# EasyEDA Pro project HLLRT_Circuit_Full.eprj

# Schematic HP-H09-01
Board Name: Board1; Create Date: 2026-09-03; Page Name: P1; Project Name: HLLRT_Circuit_Full; Schematic Name: HP-H09-01; Update Date: 2026-09-04; Company: EasyEDA.com; Page Size: A4; Version: V1.0
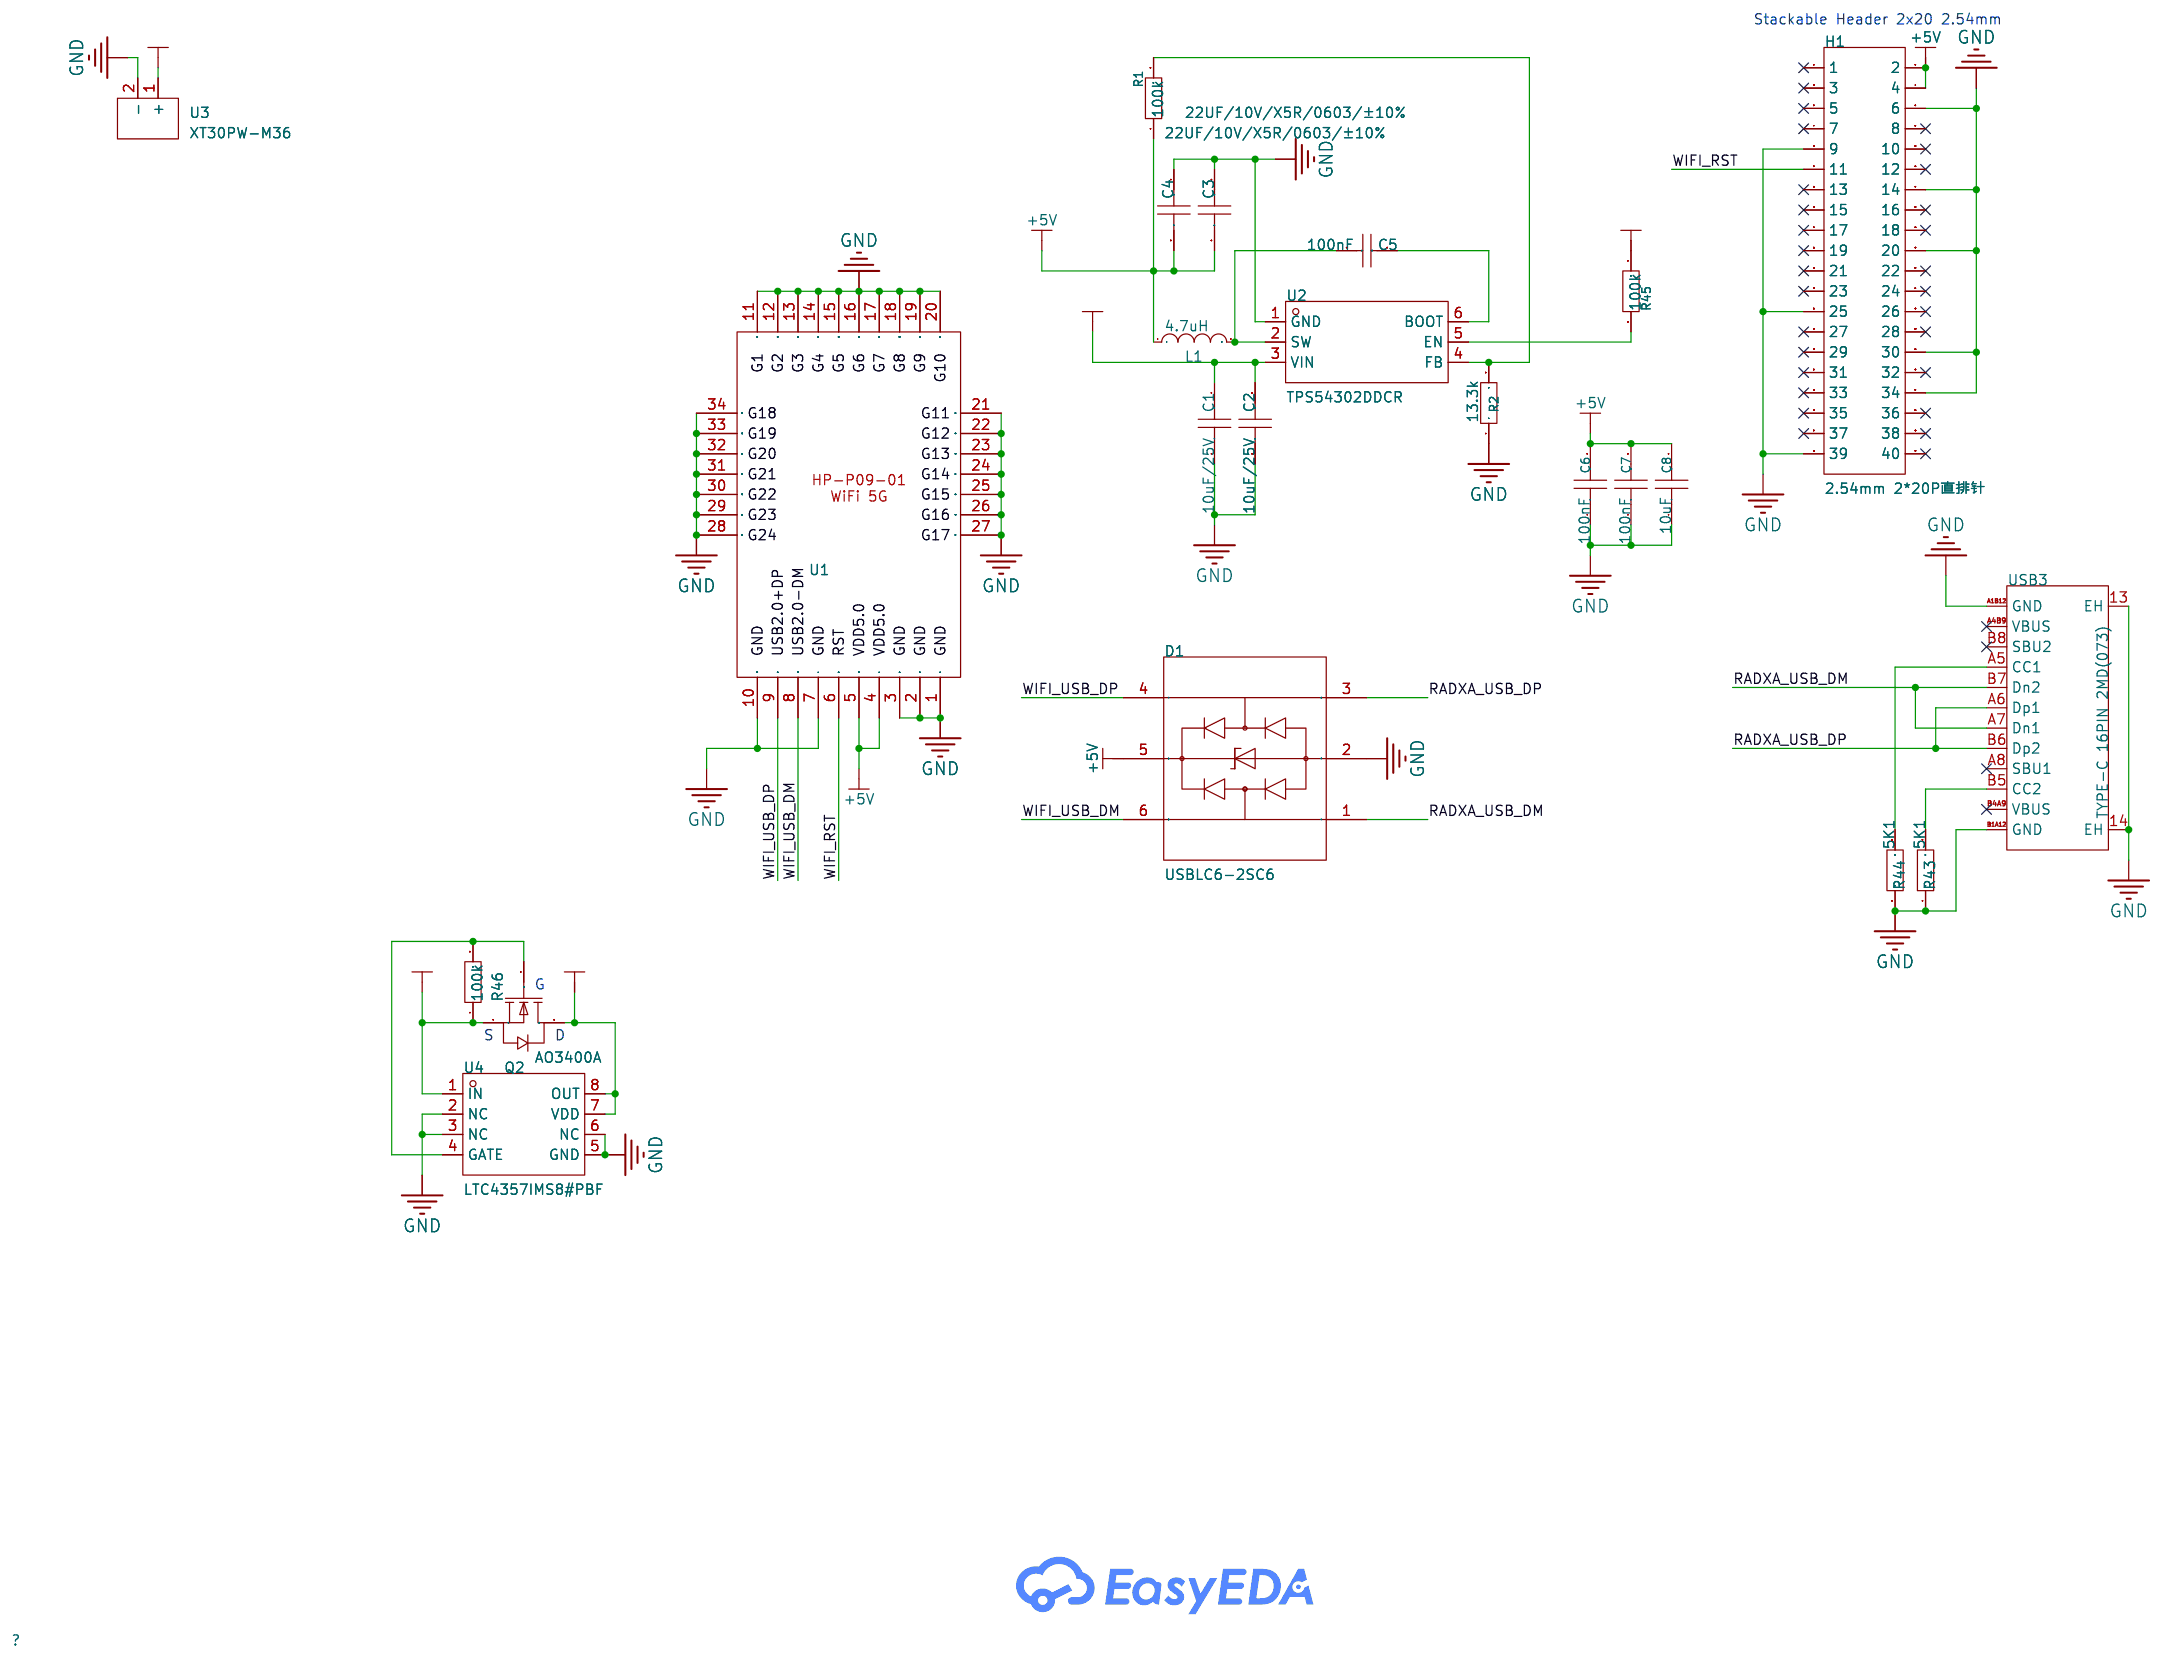
[diagram p0: schematic sheet]

## Parts
C1  10uF/25V  [C1206]
C2  10uF/25V  [C1206]
C3  22UF/10V/X5R/0603/±10%  [C0603]
C4  22UF/10V/X5R/0603/±10%  [C0603]
C5  100nF  [C0603]
C6  100nF  [C0603]
C7  100nF  [C0603]
C8  10uF  [C0603]
D1  USBLC6-2SC6  [SOT-23-6_L2.9-W1.6-P0.95-LS2.8-BL]
H1  2.54mm 2*20P直排针  [HDR-TH_40P-P2.54-V-M-R2-C20-S2.54]
L1  4.7uH  [IND-SMD_L7.3-W7.3_SCDS74T]
Q2  AO3400A  [SOT-23-3_L2.9-W1.3-P1.90-LS2.4-BR]
R1  100k  [R0603]
R2  13.3k  [R0603]
R43  5K1  [R0603]
R44  5K1  [R0603]
R45  100k  [R0603]
R46  100k  [R0603]
U1  -  [HP-H01-01]
U2  TPS54302DDCR  [SOT-23-6_L2.9-W1.6-P0.95-LS2.8-BL]
U3  XT30PW-M36  [CONN-TH_2P-P5.00_XT30PW-M36]
U4  LTC4357IMS8#PBF  [MSOP-8_L3.0-W3.0-P0.65-LS5.0-BL]
USB3  TYPE-C 16PIN 2MD(073)  [USB-C-SMD_TYPE-C-16PIN-2MD-073]

## Library data of the parts
C1 C2 = CL31A476MPHNNNE: LCSC Part Name: 47uF ±20% 10V; Supplier Part: C96123; Manufacturer: SAMSUNG(三星); Supplier Footprint: 1206; JLCPCB Part Class: Basic Part; Datasheet: https://item.szlcsc.com/datasheet/CL31A476MPHNNNE/97327.html; Supplier: LCSC; Tolerance: ±20%; Voltage Rating: 10V; Temperature Coefficient: X5R
C3 C4 = 22UF/10V/X5R/0603/±10%: Supplier Part: C9900023518; JLCPCB Part Class: Extended Part; Supplier: LCSC
C5 = 0603B471K500NT: LCSC Part Name: 470pF ±10% 50V; Supplier Part: C1620; Manufacturer: FH(风华); Supplier Footprint: 0603; JLCPCB Part Class: Basic Part; Datasheet: https://item.szlcsc.com/datasheet/0603B471K500NT/1972.html; Supplier: LCSC; Tolerance: ±10%; Voltage Rating: 50V; Temperature Coefficient: X7R
C6-C8 = CL10A106MA8NRNC: LCSC Part Name: 10uF ±20% 25V; Supplier Part: C96446; Manufacturer: SAMSUNG(三星); Supplier Footprint: 0603; JLCPCB Part Class: Basic Part; Datasheet: https://item.szlcsc.com/datasheet/CL10A106MA8NRNC/97651.html; Supplier: LCSC; Tolerance: ±20%; Voltage Rating: 25V; Temperature Coefficient: X5R
D1 = USBLC6-2SC6: LCSC Part Name: ESD二极管 USBLC6-2SC6; Supplier Part: C323793; Supplier Footprint: SOT-23-6; JLCPCB Part Class: Extended Part; Datasheet: https://atta.szlcsc.com/upload/public/pdf/source/20181029/C323793_48F7908330A3F84485333C8DC43F9E49.pdf; Supplier: LCSC; Reverse Stand-Off Voltage (Vrwm): 5V; Maximum Clamping Voltage: 20V; Peak Pulse Current (Ipp)@10/1000us: 5A; Breakdown Voltage: 6V; Type: ESD
H1 = 2.54mm 2*20P直排针: LCSC Part Name: 2x20P 间距:2.54mm 方针 直插; Supplier Part: C50980; Manufacturer: BOOMELE(博穆精密); Supplier Footprint: 插件,P=2.54mm; JLCPCB Part Class: Extended Part; Datasheet: https://item.szlcsc.com/datasheet/2.54mm%25202*20P%25E7%259B%25B4%25E6%258E%2592%25E9%2592%2588/51992.html; Supplier: LCSC; Pin Structure: 2x20P; Pitch: 2.54mm; Row Spacing: 2.54mm; Circluar Pins/Square Pins: Pin Header; Mounting Type: Through Hole; Number of Rows: 2; Number of Pins: 40P; Current Rating: 3A; Length of Mating Pin: 6mm; Length of End Connection Pin: 3mm; Contact Material: Brass; Operating Temperature: -40℃~+105℃; Color: Black
L1 = L74R/4.7UH: LCSC Part Name: 4.2uH ±20% 7A; Supplier Part: C48686194; Manufacturer: YONGYUTAI(永裕泰); Supplier Footprint: SMD,7.3x7.3mm; JLCPCB Part Class: Extended Part; Datasheet: https://item.szlcsc.com/datasheet/L74R%252F4.7UH/50971527.html; Supplier: LCSC; Tolerance: ±20%; Current - Saturation(Isat): 7A; DC Resistance(DCR): 30mΩ
Q2 = AO3400A_C20917: LCSC Part Name: N沟道 耐压:30V; Supplier Part: C20917; Manufacturer: AOS; Supplier Footprint: SOT-23; JLCPCB Part Class: Basic Part; Datasheet: https://item.szlcsc.com/datasheet/AO3400A/21629.html; Supplier: LCSC; Number: 1 N-channel; Drain to Source Voltage: 30V; Current - Continuous Drain(Id): 5.7A; RDS(on): 48mΩ@2.5V; Pd - Power Dissipation: 1.4W; Gate Threshold Voltage (Vgs(th)): 1.45V; Gate Charge(Qg): 7nC@10V; Input Capacitance(Ciss): 630pF; Reverse Transfer Capacitance (Crss@Vds): 50pF; Operating Temperature: -55℃~+150℃; Type: N-Channel; Output Capacitance(Coss): 75pF; Vgs: ±12V
R1 R2 R45 = 0603WAF2200T5E: LCSC Part Name: 220Ω ±1% 100mW 厚膜电阻; Supplier Part: C22962; Manufacturer: UNI-ROYAL(厚声); Supplier Footprint: 0603; JLCPCB Part Class: Basic Part; Datasheet: https://atta.szlcsc.com/upload/public/pdf/source/20200306/C422600_1E6D84923E4A46A82E41ADD87F860B5C.pdf; Supplier: LCSC; Type: Thick Film Resistors; Tolerance: ±1%; Temperature Coefficient: ±100ppm/℃; Operating Temperature Range: -55℃~+155℃
R43 R44 R46 = Res_0603: Supplier Footprint: 0603
U1 = HP-H09-01
U2 = TPS54302DDCR_C311983: LCSC Part Name: 降压型 3A 4.5V~28V; Supplier Part: C311983; Manufacturer: TI(德州仪器); Supplier Footprint: TSOT-23-6; JLCPCB Part Class: Extended Part; Datasheet: https://www.ti.com/cn/lit/gpn/tps54302; Supplier: LCSC; Function: Step-down type; Voltage - Supply: 4.5V~28V; Output Current: 3A; Frequency - Switching: 400kHz; Operating Temperature: -40℃~+125℃@(TJ); Synchronous Rectifier: Yes; Number of Outputs: 1; Topology: Buck; Quiescent Current: 45uA; Switch tube (built-in/external): Built-in; Output Type: Adjustable; Features: Light load efficient mode；Cycle-by-cycle current limiting；Overcurrent Protection；EMI optimization (spread spectrum)；Hiccup current limiting
U3 = XT30PW-M36: Supplier Part: C9900222726; Supplier Footprint: XT30; Supplier: LCSC
U4 = LTC4357IMS8#PBF: LCSC Part Name: 正高电压理想二极管控制器; Supplier Part: C580864; Manufacturer: ADI(亚德诺); Supplier Footprint: MSOP-8; JLCPCB Part Class: Extended Part; Datasheet: https://item.szlcsc.com/datasheet/LTC4357IMS8%2523PBF/608641.html; Supplier: LCSC
USB3 = TYPE-C 16PIN 2MD(073): Connector Type:Type-C Protocol Standard:- Gender:Female Mounting Type:Surface Mount, Right Angle Number of Contacts:16P Number of Ports:1 Current Rating-Power:3A Voltage Rating:5V Connect-Disconnect Life:10,000 cycles Supplementary Features:- Center Heigh; LCSC Part Name: Type-C 母 卧贴; Supplier Part: C2765186; Manufacturer: SHOU HAN(首韩); Supplier Footprint: SMD; JLCPCB Part Class: Extended Part; Datasheet: https://item.szlcsc.com/datasheet/TYPE-C%252016PIN%25202MD(073)/2901843.html; Supplier: LCSC; Connector Type: Type-C; Gender: Female; Mounting Type: Surface Mount, Right Angle; Number of Contacts: 16P; Number of Ports: 1; Current Rating-Power: 3A; Voltage Rating: 5V; Connect-Disconnect Life: 10,000 cycles; Detection color: Black; Operating Temperature: -25℃~+85℃

## Nets
+5V: C3.2 C4.2 C6.2 C7.2 C8.2 D1.5 H1.2 H1.4 L1.1 R1.1 U1.4 U1.5
GND: C1.1 C2.1 C3.1 C4.1 C6.1 C7.1 C8.1 D1.2 H1.6 H1.9 H1.14 H1.20 H1.25 H1.30 H1.34 H1.39 R2.1 R43.1 R44.1 U1.1 U1.2 U1.3 U1.7 U1.10 U1.11 U1.12 U1.13 U1.14 U1.15 U1.16 U1.17 U1.18 U1.19 U1.20 U1.21 U1.22 U1.23 U1.24 U1.25 U1.26 U1.27 U1.28 U1.29 U1.30 U1.31 U1.32 U1.33 U1.34 U2.1(GND) U3.2(-) U4.2(NC) U4.3(NC) U4.5(GND) U4.6(NC) USB3.13(EH) USB3.14(EH) USB3.A1B12(GND) USB3.B1A12(GND)
VIN_BAT: C1.2 C2.2 Q2.3(D) R45.1 U2.3(VIN) U4.7(VDD) U4.8(OUT)
3S-4S: Q2.2(S) R46.1 U3.1(+) U4.1(IN)
RADXA_USB_DM: D1.1 USB3.A7(Dn1) USB3.B7(Dn2)
RADXA_USB_DP: D1.3 USB3.A6(Dp1) USB3.B6(Dp2)
WIFI_RST: H1.11 U1.6
WIFI_USB_DM: D1.6 U1.8
WIFI_USB_DP: D1.4 U1.9
$1N1982: C5.1 L1.2 U2.2(SW)
$1N3918: R44.2 USB3.A5(CC1)
$1N3919: R43.2 USB3.B5(CC2)
$1N5216: R45.2 U2.5(EN)
$1N5862: Q2.1(G) R46.2 U4.4(GATE)
$1N6068: C5.2 U2.6(BOOT)
$1N6073: R1.2 R2.2 U2.4(FB)

Not connected (* = marked no-connect by the designer): H1 1* 3* 5* 7* 8* 10* 12* 13* 15* 16* 17* 18* 19* 21* 22* 23* 24* 26* 27* 28* 29* 31* 32* 33* 35* 36* 37* 38* 40*; USB3 A4B9(VBUS)* A8(SBU1)* B4A9(VBUS)* B8(SBU2)*

## Notes on the sheet
- Stackable Header 2x20 2.54mm
- G
- S
- D

# Board PCB1
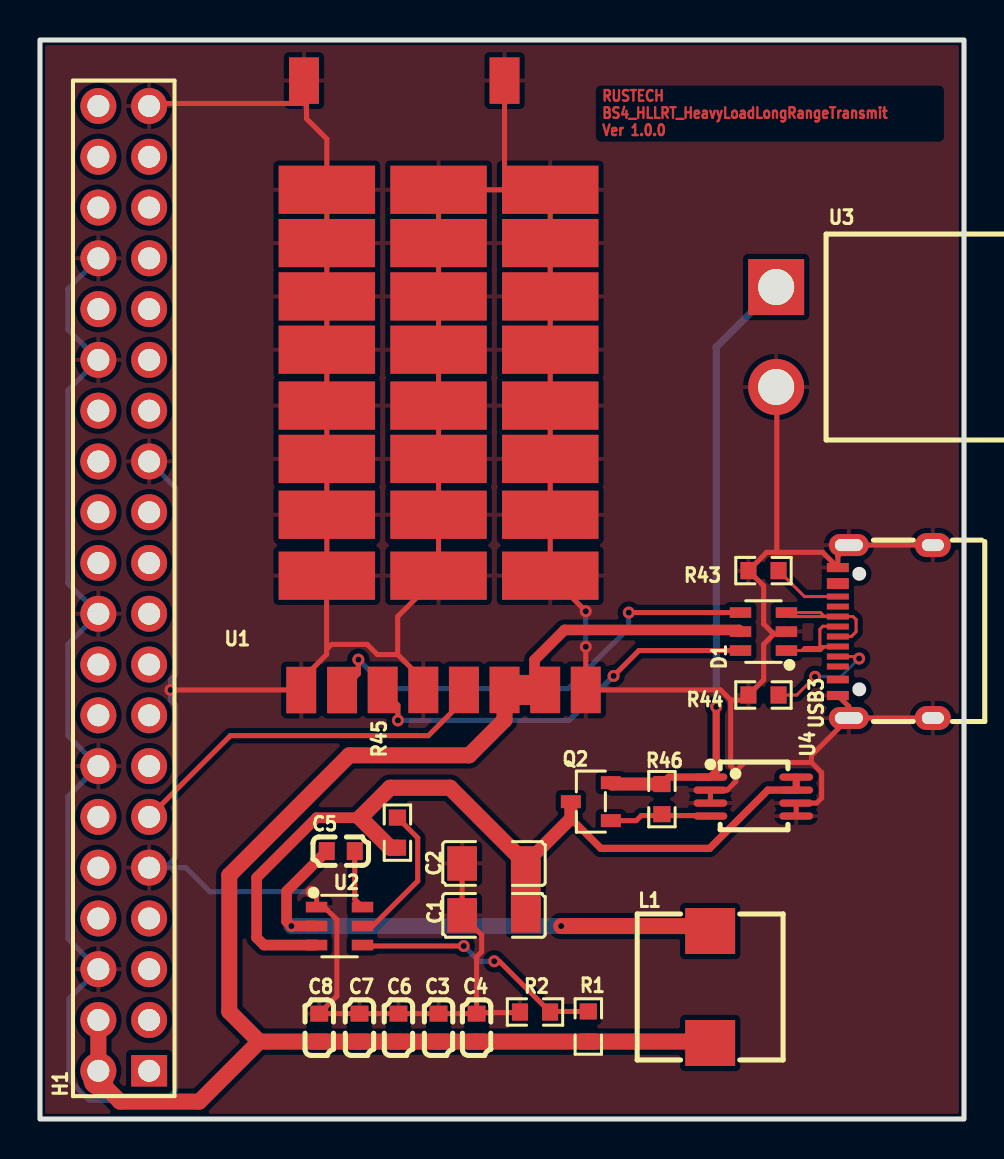
[diagram p1: board, top side]
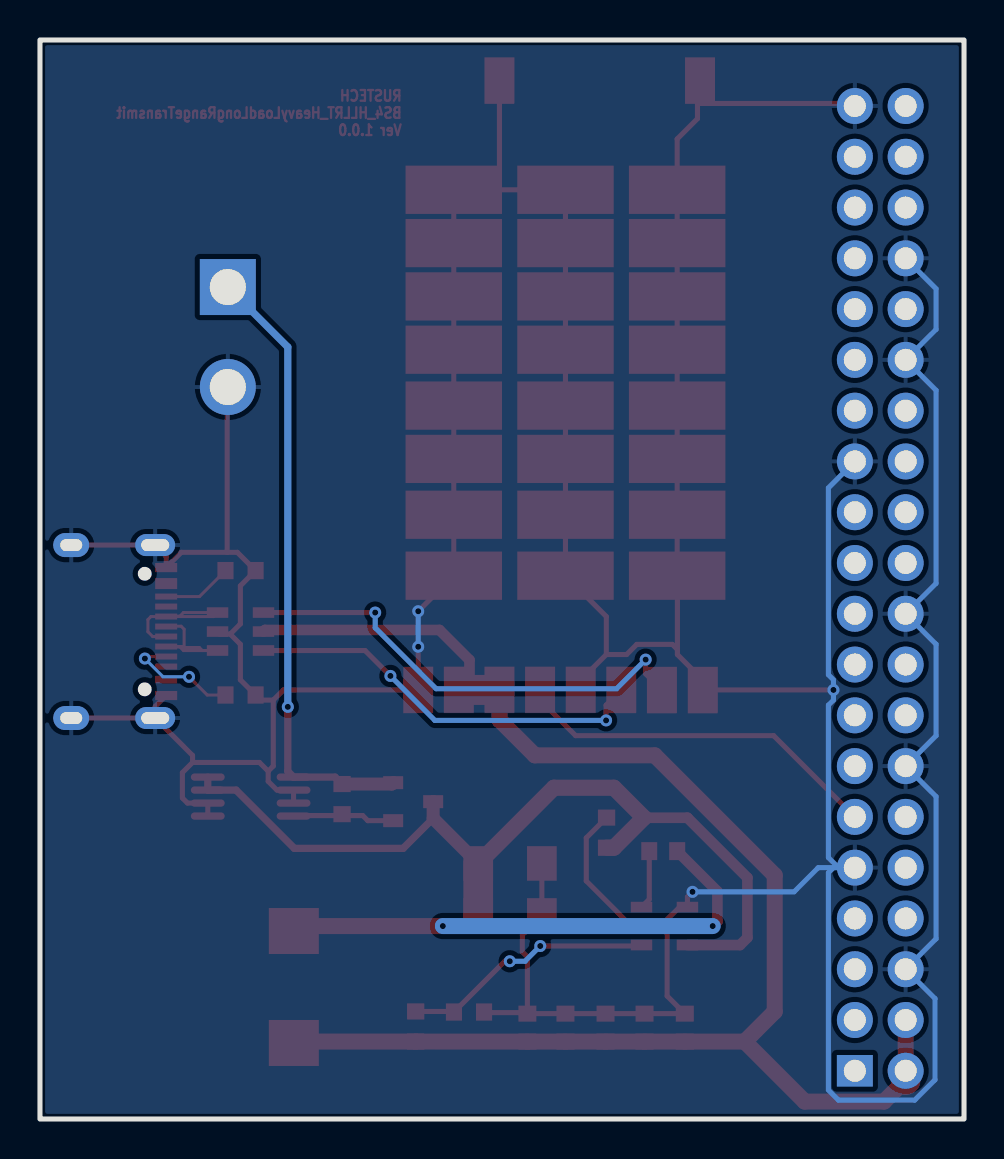
[diagram p2: board, bottom side, seen from below]

Outline 46.23 x 53.98 mm; copper layers: Top Layer, Bottom Layer. Coordinates in mm from the lower left corner of the outline.
Outline path: rectangle 0,53.98 46.23,0
Stack: Top Layer 0.035mm / Dielectric1 1.51mm FR4 er 4.5 / Bottom Layer 0.035mm

## Design rules (mm)
net +5V: PWR
net 3S-4S: PWR
net $1N1982: PWR
net $1N3919: Ok
net $1N3918: Ok
net VIN_BAT: PWR
template: PWR
spacing copperThickness1oz (default): track to track 0.254, other pairs 0.152 to 0.254
spacing copperThickness2oz: track to track 0.203, other pairs 0.152 to 0.3
track width copperThickness1oz (default): min 0.127, default 0.254, max 2.54
track width copperThickness2oz: min 0.203, default 0.254, max 2.54
track width Power_Width: min 0.127, default 1.5, max 2.54
track width USB: min 0.127, default 0.152, max 2.54
track width Ok: min 0.127, default 0.152, max 2.54
differential pair differentialPair (default): width min 0.127, default 0.254, max 2.54; gap min 0.152, default 0.152
via viaSize (default): diameter min 0.5, default 0.6, max 10; hole min 0.3, default 0.305, max 6.3
net class PWR uses Power_Width
net class Ok uses Ok
net +5V uses Power_Width
net 3S-4S uses Power_Width
net RADXA_USB_DM uses USB
net RADXA_USB_DP uses USB
net $1N1982 uses Power_Width
net $1N3919 uses Ok
net $1N3918 uses Ok
net VIN_BAT uses Power_Width
['net', '3s-4s'] ['NET', '+5V'] uses default

## Placement (name value [footprint] x y rotation side)
C1  10uF/25V  [C1206]  22.71 10.18 0 top
C2  10uF/25V  [C1206]  22.71 12.78 0 top
C3  22UF/10V/X5R/0603/±10%  [C0603]  19.94 4.57 270 top
C4  22UF/10V/X5R/0603/±10%  [C0603]  21.84 4.57 270 top
C5  100nF  [C0603]  15.05 13.4 0 top
C6  100nF  [C0603]  17.93 4.57 270 top
C7  100nF  [C0603]  15.98 4.57 270 top
C8  10uF  [C0603]  13.97 4.57 270 top
D1  USBLC6-2SC6  [SOT-23-6_L2.9-W1.6-P0.95-LS2.8-BL]  36.19 24.38 90 top
H1  2.54mm 2*20P直排针  [HDR-TH_40P-P2.54-V-M-R2-C20-S2.54]  4.19 26.54 90 top
L1  4.7uH  [IND-SMD_L7.3-W7.3_SCDS74T]  33.53 6.6 90 top
Q2  AO3400A  [SOT-23-3_L2.9-W1.3-P1.90-LS2.4-BR]  27.56 15.88 0 top
R1  100k  [R0603]  27.43 4.63 90 top
R2  13.3k  [R0603]  24.76 5.35 0 top
R43  5K1  [R0603]  36.19 27.43 0 top
R44  5K1  [R0603]  36.19 21.21 0 top
R45  100k  [R0603]  17.88 14.32 90 top
R46  100k  [R0603]  31.12 16 270 top
U1  -  [HP-H01-01]  9.53 21.46 0 top
U2  TPS54302DDCR  [SOT-23-6_L2.9-W1.6-P0.95-LS2.8-BL]  14.99 9.65 270 top
U3  XT30PW-M36  [CONN-TH_2P-P5.00_XT30PW-M36]  36.83 39.12 90 top
U4  LTC4357IMS8#PBF  [MSOP-8_L3.0-W3.0-P0.65-LS5.0-BL]  35.69 16.13 270 top
USB3  TYPE-C 16PIN 2MD(073)  [USB-C-SMD_TYPE-C-16PIN-2MD-073]  42.29 24.38 90 top

## Footprints (pads in the part's own frame, mm; a bottom-side part is the same pattern mirrored in y, then rotated)
C0603
  rect 0.8x0.9 smd: 1(-0.7,0) 2(0.7,0)
C1206
  rect 1.485x1.728 smd: 1(-1.593,0) 2(1.593,0)
CONN-TH_2P-P5.00_XT30PW-M36
  rect 2.8x2.8 hole 1.8: 1(2.5,0)
  round 2.8 hole 1.8: 2(-2.5,0)
HDR-TH_40P-P2.54-V-M-R2-C20-S2.54
  rect 1.575x1.8 hole 1.1: 1(-24.13,-1.27)
  round 1.8 hole 1.1: 2(-24.13,1.27) 3(-21.59,-1.27) 4(-21.59,1.27) 5(-19.05,-1.27) 6(-19.05,1.27) 7(-16.51,-1.27) 8(-16.51,1.27) 9(-13.97,-1.27) 10(-13.97,1.27) 11(-11.43,-1.27) 12(-11.43,1.27) 13(-8.89,-1.27) 14(-8.89,1.27) 15(-6.35,-1.27) 16(-6.35,1.27) 17(-3.81,-1.27) 18(-3.81,1.27) 19(-1.27,-1.27) 20(-1.27,1.27) 21(1.27,-1.27) 22(1.27,1.27) 23(3.81,-1.27) 24(3.81,1.27) 25(6.35,-1.27) 26(6.35,1.27) 27(8.89,-1.27) 28(8.89,1.27) 29(11.43,-1.27) 30(11.43,1.27) 31(13.97,-1.27) 32(13.97,1.27) 33(16.51,-1.27) 34(16.51,1.27) 35(19.05,-1.27) 36(19.05,1.27) 37(21.59,-1.27) 38(21.59,1.27) 39(24.13,-1.27) 40(24.13,1.27)
HP-H01-01
  custom 1.5x2.327 smd: 1(3.683,30.48) 2(13.716,30.48) 3(17.78,0) 4(15.748,0) 5(13.716,0) 6(11.684,0) 7(9.652,0) 8(7.62,0) 9(5.588,-0.007) 10(3.544,-0.007)
  custom 4.826x2.413 smd: 11(4.826,25.019) 12(10.414,25.019) 13(16.002,25.019) 14(4.826,22.352) 15(10.414,22.352) 16(4.826,19.685) 17(10.414,19.685) 18(16.002,19.685) 19(4.826,17.018) 20(10.414,17.018) 21(16.002,17.018) 22(4.826,14.224) 23(10.414,14.224) 24(16.002,14.224) 25(4.826,11.557) 26(10.414,11.557) 27(16.002,11.557) 28(4.826,8.763) 29(10.414,8.763) 30(16.002,8.763) 31(4.826,5.715) 32(10.414,5.715) 33(16.002,5.715) 34(16.002,22.352)
IND-SMD_L7.3-W7.3_SCDS74T
  rect 2.3x2.5 smd: 1(-2.8,0) 2(2.8,0)
MSOP-8_L3.0-W3.0-P0.65-LS5.0-BL
  oval 0.364x1.692 smd: 1(-0.975,-2.146) 2(-0.325,-2.146) 3(0.325,-2.146) 4(0.975,-2.146) 5(0.975,2.146) 6(0.325,2.146) 7(-0.325,2.146) 8(-0.975,2.146)
R0603
  rect 0.806x0.864 smd: 1(-0.753,0) 2(0.753,0)
SOT-23-3_L2.9-W1.3-P1.90-LS2.4-BR
  rect 1x0.65 smd: 1(1,-0.95) 2(1,0.95) 3(-1,0)
SOT-23-6_L2.9-W1.6-P0.95-LS2.8-BL
  rect 0.532x1.072 smd: 1(-0.95,-1.149) 2(0,-1.149) 3(0.95,-1.149) 4(0.95,1.149) 5(0,1.149) 6(-0.95,1.149)
USB-C-SMD_TYPE-C-16PIN-2MD-073
  oval 1.1x2 hole 0.6x1.4: 13(-4.325,1.825) 14(4.325,1.825)
  oval 1.2x1.8 hole 0.6x1.1: 13(-4.325,-2.375) 14(4.325,-2.375)
  rect 0.457x1.1 smd: A1B12(-3.2,2.375) B1A12(3.2,2.375)
  rect 0.381x1.1 smd: A4B9(-2.4,2.375)
  rect 0.3x1.1 smd: A5(-1.25,2.375) A6(-0.25,2.375) A7(0.25,2.375) A8(1.25,2.375) B5(1.75,2.375) B6(0.75,2.375) B7(-0.75,2.375) B8(-1.75,2.375)
  rect 0.55x1.1 smd: B4A9(2.4,2.375)

## Nets
As in the schematic.

Pads without a net: H1 1 3 5 7 8 10 12 13 15 16 17 18 19 21 22 23 24 26 27 28 29 31 32 33 35 36 37 38 40; USB3 A4B9 A8 B4A9 B8

## Via types
v1: diameter 0.6, hole 0.305, Top Layer to Bottom Layer, 15 vias

## Routing (per net, layer and track width the routed paths; a pad name or vN(x,y) marks a point on that pad's centre or on a via; arc(x,y) is an arc through that point)
+5V: length 77.2
  Top Layer w0.532: D1.5 34.97,24.46 26.24,24.46 24.74,22.96 24.74,21.46
  Top Layer w0.8: 10.97,3.87 7.97,0.87 4,0.87 2.92,1.95 ; 10.97,3.87 9.47,5.37 9.47,12.19 15.47,18.19 21.47,18.19 23.24,19.96 U1.5 ; 10.97,3.87 C8.2 C7.2 C6.2 C3.2 C4.2 R1.1 ; H1.2 H1.4
  Top Layer w0.806: L1.1 33.46,3.87 R1.1
  Top Layer w1.5: U1.5 U1.4 ; 2.92,1.95 H1.2
GND: length 290.4
  Top Layer w0.254: U1.7 19.18,21.95 17.9,23.23 ; 23.24,46.48 U1.2 ; 23.24,46.48 U1.13 U1.34 U1.18 U1.21 U1.24 U1.27 U1.30 U1.33 v1(27.31,25.4) ; 23.24,46.48 U1.12 U1.15 U1.17 U1.20 U1.23 U1.26 U1.29 U1.32 17.9,25.13 17.9,23.23 ; 17.9,23.23 16.88,23.23 16.37,23.74 14.59,23.74 14.34,23.49 ; 36.86,28.35 36.36,28.35 R43.1 36.2,26.67 36.2,24.77 36.71,24.26 ; 36.86,28.35 36.86,36.58 U3.2 ; 36.86,28.35 39.15,28.35 USB3.B1A12 39.92,28.16 USB3.14 USB3.14 ; USB3.13 USB3.13 ; USB3.13 38.59,18.19 38.59,17.84 ; USB3.13 40.47,20.63 USB3.A1B12 ; v1(6.53,21.46) 13.06,21.46 ; H1.39 5.59,50.8 13.34,50.8 ; 38.59,17.84 35.25,17.84 34.81,17.4 ; 38.59,17.84 39.1,17.33 39.1,16.06 38.85,15.8 U4.6 U4.5 ; v1(13.58,11.36) 13.84,11.11 U2.1 14.23,10.6 14.85,9.98 14.85,6.16 C8.1 C7.1 C6.1 C3.1 C4.1 21.84,5.32 ; 34.81,17.4 34.56,17.65 34.56,20.95 ; 34.81,17.4 34.81,16.89 34.37,16.45 33.54,16.45 33.54,15.8 ; 34.56,20.95 34.05,21.46 U1.3 v1(27.31,23.62) ; 34.56,20.95 35.19,20.95 R44.1 36.2,21.97 36.2,23.75 36.71,24.26 ; 13.34,50.8 13.34,51.82 U1.1 ; 13.34,50.8 13.34,50.04 14.35,49.02 U1.11 U1.14 U1.16 U1.19 U1.22 U1.25 U1.28 U1.31 14.34,27.17 14.34,23.49 ; C2.1 C1.1 22.1,9.21 22.1,8.37 21.84,8.12 21.84,5.32 ; 14.34,23.49 14.34,23.23 13.07,21.96 13.07,21.46 ; 21.84,5.32 23.98,5.32 R2.1 ; 36.71,24.26 37.22,24.26 D1.2
  Bottom Layer w0.254: v1(27.31,25.4) v1(27.31,23.62) ; v1(13.58,11.36) 8.5,11.36 7.29,12.57 6.53,12.57 ; 6.53,12.57 6.79,12.32 6.79,1.45 6.28,0.94 2.47,0.94 1.45,1.96 1.45,6.02 H1.6 1.4,9.02 1.4,16.13 H1.14 1.4,19.18 1.4,23.75 H1.20 1.4,26.8 1.4,36.45 2.92,37.97 1.4,39.5 1.4,41.53 2.92,43.05 ; 6.53,12.57 6.28,12.57 ; 6.28,12.57 6.79,13.08 6.79,20.7 6.53,20.95 v1(6.53,21.46) 6.53,21.97 6.79,22.23 6.79,31.57 H1.25 ; 6.28,12.57 H1.9
VIN_BAT: length 45.9
  Top Layer w0.364: 26.56,15.04 28.06,13.54 33.5,13.54 36.42,16.45 U4.7 U4.8
  Top Layer w0.532: 16.02,15.07 13.84,15.07 10.84,12.07 10.84,9.07 11.21,8.7 U2.3
  Top Layer w0.65: C2.2 26.56,15.04 Q2.3
  Top Layer w0.806: R45.1 17.52,13.57 16.02,15.07 17.52,16.57 20.52,16.57 C2.2
  Top Layer w1.485: C1.2 C2.2
3S-4S: length 31
  Top Layer w0.364: R46.1 31.46,17.1 33.54,17.1 33.83,17.39 v1(33.83,20.62)
  Top Layer w0.65: Q2.2 28.63,16.76 R46.1
  Bottom Layer w0.364: U3.1 33.83,38.62 v1(33.83,20.62)
RADXA_USB_DM: length 6.4
  Top Layer w0.152: D1.1 38.1,23.43 ; 38.1,23.43 39.05,23.43 39.23,23.61 39.9,23.61 USB3.B7 39.06,23.63 39.02,23.59 ; 38.1,23.43 38.26,23.59 39.02,23.59 ; USB3.A7 39.9,24.65 39.17,24.65 39.02,24.5 39.02,23.59
RADXA_USB_DP: length 7.9
  Top Layer w0.152: USB3.B6 37.54,25.13 D1.3 39.05,25.33 39.23,25.15 39.9,25.15 USB3.B6 ; USB3.B6 40.68,25.13 40.83,24.98 40.83,24.37 40.59,24.13 USB3.A6
WIFI_RST: length 18.7
  Top Layer w0.254: H1.11 9.53,19.18 19.43,19.18 21.21,20.95 U1.6
WIFI_USB_DM: length 20.4
  Top Layer w0.254: U1.8 17.91,20.7 v1(17.91,19.94) ; v1(28.7,22.16) 29.97,23.43 D1.6
  Bottom Layer w0.254: v1(28.7,22.16) 26.47,19.94 v1(17.91,19.94)
WIFI_USB_DP: length 23.6
  Top Layer w0.254: D1.4 v1(29.46,25.33) ; v1(15.93,22.98) 15.93,22.27 U1.9
  Bottom Layer w0.254: v1(15.93,22.98) 17.38,21.52 26.41,21.52 29.46,24.57 v1(29.46,25.33)
$1N1982: length 27
  Top Layer w0.532: C5.1 12.34,11.39 12.34,9.89 v1(12.57,9.65) U2.2
  Top Layer w0.8: v1(26.07,9.65) 33.28,9.65 L1.2
  Bottom Layer w0.8: v1(12.57,9.65) v1(26.07,9.65)
$1N3918: length 5.9
  Top Layer w0.152: USB3.A5 40.88,23.13 v1(40.98,23.03) ; v1(38.77,22.12) 37.86,21.21 R44.2
  Bottom Layer w0.152: v1(40.98,23.03) 40.07,22.12 v1(38.77,22.12)
$1N3919: length 3.5
  Top Layer w0.152: USB3.B5 38.25,26.13 R43.2
$1N5216: length 7.3
  Top Layer w0.254: R45.2 18.9,14.06 18.9,11.91 16.64,9.65 U2.5
$1N5862: length 5.2
  Top Layer w0.254: 31.1,15.18 33.52,15.18 33.54,15.15 ; 31.1,15.18 31.1,15.23 R46.2 ; 31.1,15.18 30.08,15.18 29.83,14.92 Q2.1
$1N6068: length 3
  Top Layer w0.254: C5.2 15.75,10.99 U2.6
$1N6073: length 12.7
  Top Layer w0.254: v1(22.72,7.89) 22.98,7.89 R2.2 25.55,5.38 R1.2 ; U2.4 16.18,8.65 v1(21.2,8.65)
  Bottom Layer w0.254: v1(22.72,7.89) 21.96,7.89 v1(21.2,8.65)

## Copper pours and planes (outline as drawn; the poured copper is in the pictures)
GND on Top Layer: 0,53.98 46.23,53.98 46.23,0 0,0
GND on Bottom Layer: 0,53.98 46.23,53.98 46.23,0 0,0

## Text on the board
Top Layer: RUSTECH / BS4_HLLRT_HeavyLoadLongRangeTransmit / Ver 1.0.0
